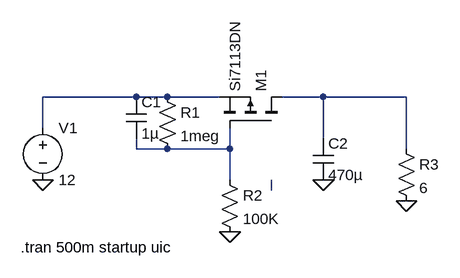
[diagram p0: schematic InrushLimit.asc]
InrushLimit.asc, the LTspice schematic file:
Version 4
SHEET 1 880 680
WIRE 16 160 -128 160
WIRE 64 160 16 160
WIRE 144 160 64 160
WIRE 304 160 240 160
WIRE 432 160 304 160
WIRE -128 208 -128 160
WIRE 304 224 304 160
WIRE 16 240 16 224
WIRE 64 240 16 240
WIRE 160 240 160 208
WIRE 160 240 64 240
WIRE 432 240 432 160
WIRE 160 288 160 240
WIRE 224 304 224 288
FLAG 304 288 0
FLAG 160 368 0
FLAG -128 288 0
FLAG 432 320 0
SYMBOL pmos 240 208 M270
SYMATTR InstName M1
SYMATTR Value Si7113DN
SYMBOL res 48 144 R0
SYMATTR InstName R1
SYMATTR Value 1meg
SYMBOL res 144 272 R0
SYMATTR InstName R2
SYMATTR Value 100K
SYMBOL cap 0 160 R0
SYMATTR InstName C1
SYMATTR Value 1µ
SYMBOL cap 288 224 R0
SYMATTR InstName C2
SYMATTR Value 470µ
SYMATTR SpiceLine Rser=0
SYMBOL voltage -128 192 R0
WINDOW 123 0 0 Left 2
WINDOW 39 0 0 Left 2
SYMATTR InstName V1
SYMATTR Value 12
SYMBOL res 416 224 R0
SYMATTR InstName R3
SYMATTR Value 6
TEXT -162 392 Left 2 !.tran 500m startup uic

The netlist it stands for:
* InrushLimit.asc
M1 N002 N003 N001 N001 Si7113DN
R1 N001 N003 1meg
R2 N003 0 100K
C1 N001 N003 1µ
C2 N002 0 470µ Rser=0
V1 N001 0 12
R3 N002 0 6
.model NMOS NMOS
.model PMOS PMOS
.lib standard.mos
.tran 500m startup uic
.backanno
.end